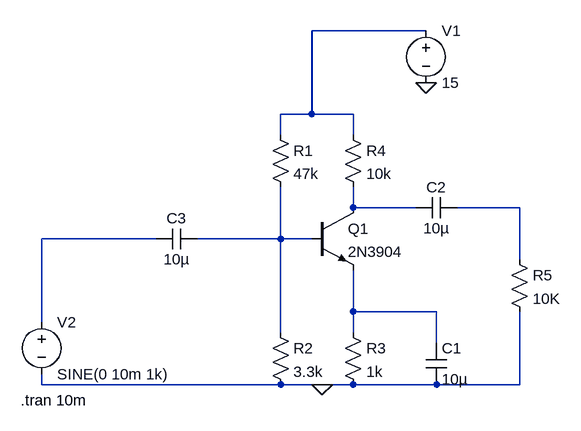
[diagram p0: schematic common_emitter.asc]
common_emitter.asc, the LTspice schematic file:
Version 4.1
SHEET 1 880 680
WIRE 368 -160 192 -160
WIRE 192 -32 192 -160
WIRE 192 -32 144 -32
WIRE 256 -32 192 -32
WIRE 144 0 144 -32
WIRE 256 0 256 -32
WIRE 256 112 256 80
WIRE 352 112 256 112
WIRE 512 112 416 112
WIRE -48 160 -224 160
WIRE 144 160 144 80
WIRE 144 160 16 160
WIRE 192 160 144 160
WIRE 512 192 512 112
WIRE 256 272 256 208
WIRE 384 272 256 272
WIRE -224 288 -224 160
WIRE 144 304 144 160
WIRE 256 304 256 272
WIRE 384 320 384 272
WIRE -224 384 -224 368
WIRE 144 384 -224 384
WIRE 208 384 144 384
WIRE 256 384 208 384
WIRE 384 384 256 384
WIRE 512 384 512 272
WIRE 512 384 384 384
FLAG 208 384 0
FLAG 368 -80 0
SYMBOL npn 192 112 R0
SYMATTR InstName Q1
SYMATTR Value 2N3904
SYMBOL res 128 -16 R0
SYMATTR InstName R1
SYMATTR Value 47k
SYMBOL res 128 288 R0
SYMATTR InstName R2
SYMATTR Value 3.3k
SYMBOL res 240 288 R0
SYMATTR InstName R3
SYMATTR Value 1k
SYMBOL res 240 -16 R0
SYMATTR InstName R4
SYMATTR Value 10k
SYMBOL cap 368 320 R0
SYMATTR InstName C1
SYMATTR Value 10µ
SYMBOL cap 416 96 R90
WINDOW 0 0 32 VBottom 2
WINDOW 3 32 32 VTop 2
SYMATTR InstName C2
SYMATTR Value 10µ
SYMBOL cap 16 144 R90
WINDOW 0 0 32 VBottom 2
WINDOW 3 32 32 VTop 2
SYMATTR InstName C3
SYMATTR Value 10µ
SYMBOL res 496 176 R0
SYMATTR InstName R5
SYMATTR Value 10K
SYMBOL voltage 368 -176 R0
SYMATTR InstName V1
SYMATTR Value 15
SYMBOL voltage -224 272 R0
SYMATTR InstName V2
SYMATTR Value SINE(0 10m 1k)
TEXT -256 408 Left 2 !.tran 10m

The netlist it stands for:
* common_emitter.asc
Q1 N002 N005 N006 0 2N3904
R1 N001 N005 47k
R2 N005 0 3.3k
R3 N006 0 1k
R4 N001 N002 10k
C1 N006 0 10µ
C2 N003 N002 10µ
C3 N005 N004 10µ
R5 N003 0 10K
V1 N001 0 15
V2 N004 0 SINE(0 10m 1k)
.model NPN NPN
.model PNP PNP
.lib standard.bjt
.tran 10m
.backanno
.end